# Altium project MAGI'sMicroSD_SDIO.PrjPcb
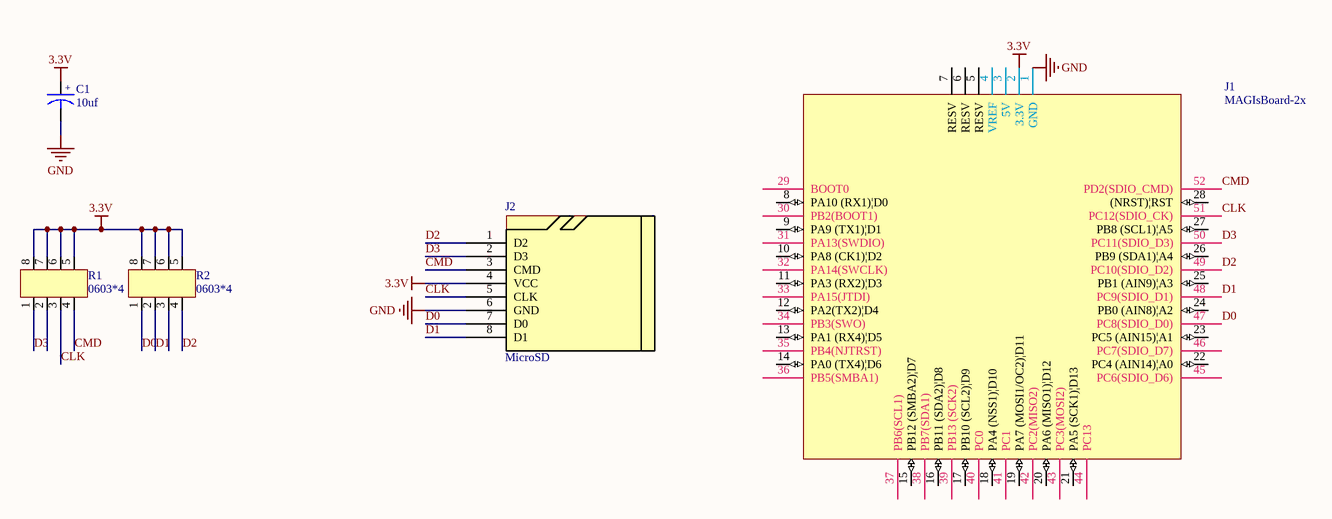
[diagram p0: MAGI'sMicroSD_SDIO.SchDoc]
1 sheet, 5 parts. Net scope: global (net labels, ports and power ports of the same name join across sheets).
Board file: MAGI'sMicroSD_SDIO.PcbDoc

## Sheet MAGI'sMicroSD_SDIO.SchDoc
size A4

### Parts
C1  10uf  [6-0805_N]
J1  MAGIsBoard-2x  [MAGIsBoard-2x]
J2  MicroSD  [microsd]
R1  0603*4  [0603*4]
R2  0603*4  [0603*4]

### Nets
3.3V: C1.1 J1.2(3.3V) J2.4(VCC) R1.5 R1.6 R1.7 R1.8 R2.5 R2.6 R2.7 R2.8
GND: C1.2 J1.1(GND) J2.6(GND)
CLK: J1.51(PC12(SDIO_CK)) J2.5(CLK) R1.3
CMD: J1.52(PD2(SDIO_CMD)) J2.3(CMD) R1.4
D0: J1.47(PC8(SDIO_D0)) J2.7(D0) R2.1
D1: J1.48(PC9(SDIO_D1)) J2.8(D1) R2.2
D2: J1.49(PC10(SDIO_D2)) J2.1(D2) R2.4
D3: J1.50(PC11(SDIO_D3)) J2.2(D3) R1.1

Not connected (* = marked no-connect by the designer): J1 3(5V) 4(VREF) 5(RESV) 6(RESV) 7(RESV) 8(PA10_(RX1)|D0) 9(PA9_(TX1)|D1) 10(PA8_(CK1)|D2) 11(PA3_(RX2)|D3) 12(PA2(TX2)|D4) 13(PA1_(RX4)|D5) 14(PA0_(TX4)|D6) 15(PB12_(SMBA2)|D7) 16(PB11_(SDA2)|D8) 17(PB10_(SCL2)|D9) 18(PA4_(NSS1)|D10) 19(PA7_(MOSI1/OC2)|D11) 20(PA6_(MISO1)|D12) 21(PA5_(SCK1)|D13) 22(PC4_(AIN14)|A0) 23(PC5_(AIN15)|A1) 24(PB0_(AIN8)|A2) 25(PB1_(AIN9)|A3) 26(PB9_(SDA1)|A4) 27(PB8_(SCL1)|A5) 28((NRST)|RST) 29(BOOT0) 30(PB2(BOOT1)) 31(PA13(SWDIO)) 32(PA14(SWCLK)) 33(PA15(JTDI)) 34(PB3(SWO)) 35(PB4(NJTRST)) 36(PB5(SMBA1)) 37(PB6(SCL1)) 38(PB7(SDA1)) 39(PB13_(SCK2)) 40(PC0) 41(PC1) 42(PC2(MISO2)) 43(PC3(MOSI2)) 44(PC13) 45(PC6(SDIO_D6)) 46(PC7(SDIO_D7)); R1 2; R2 3

### Notes on the sheet
- (in symbol CAPACITOR POL) +

### Library data of the parts
C1 = CAPACITOR POL: Capacitor